# EAGLE schematic stm32-d40 (EAGLE 6.4)
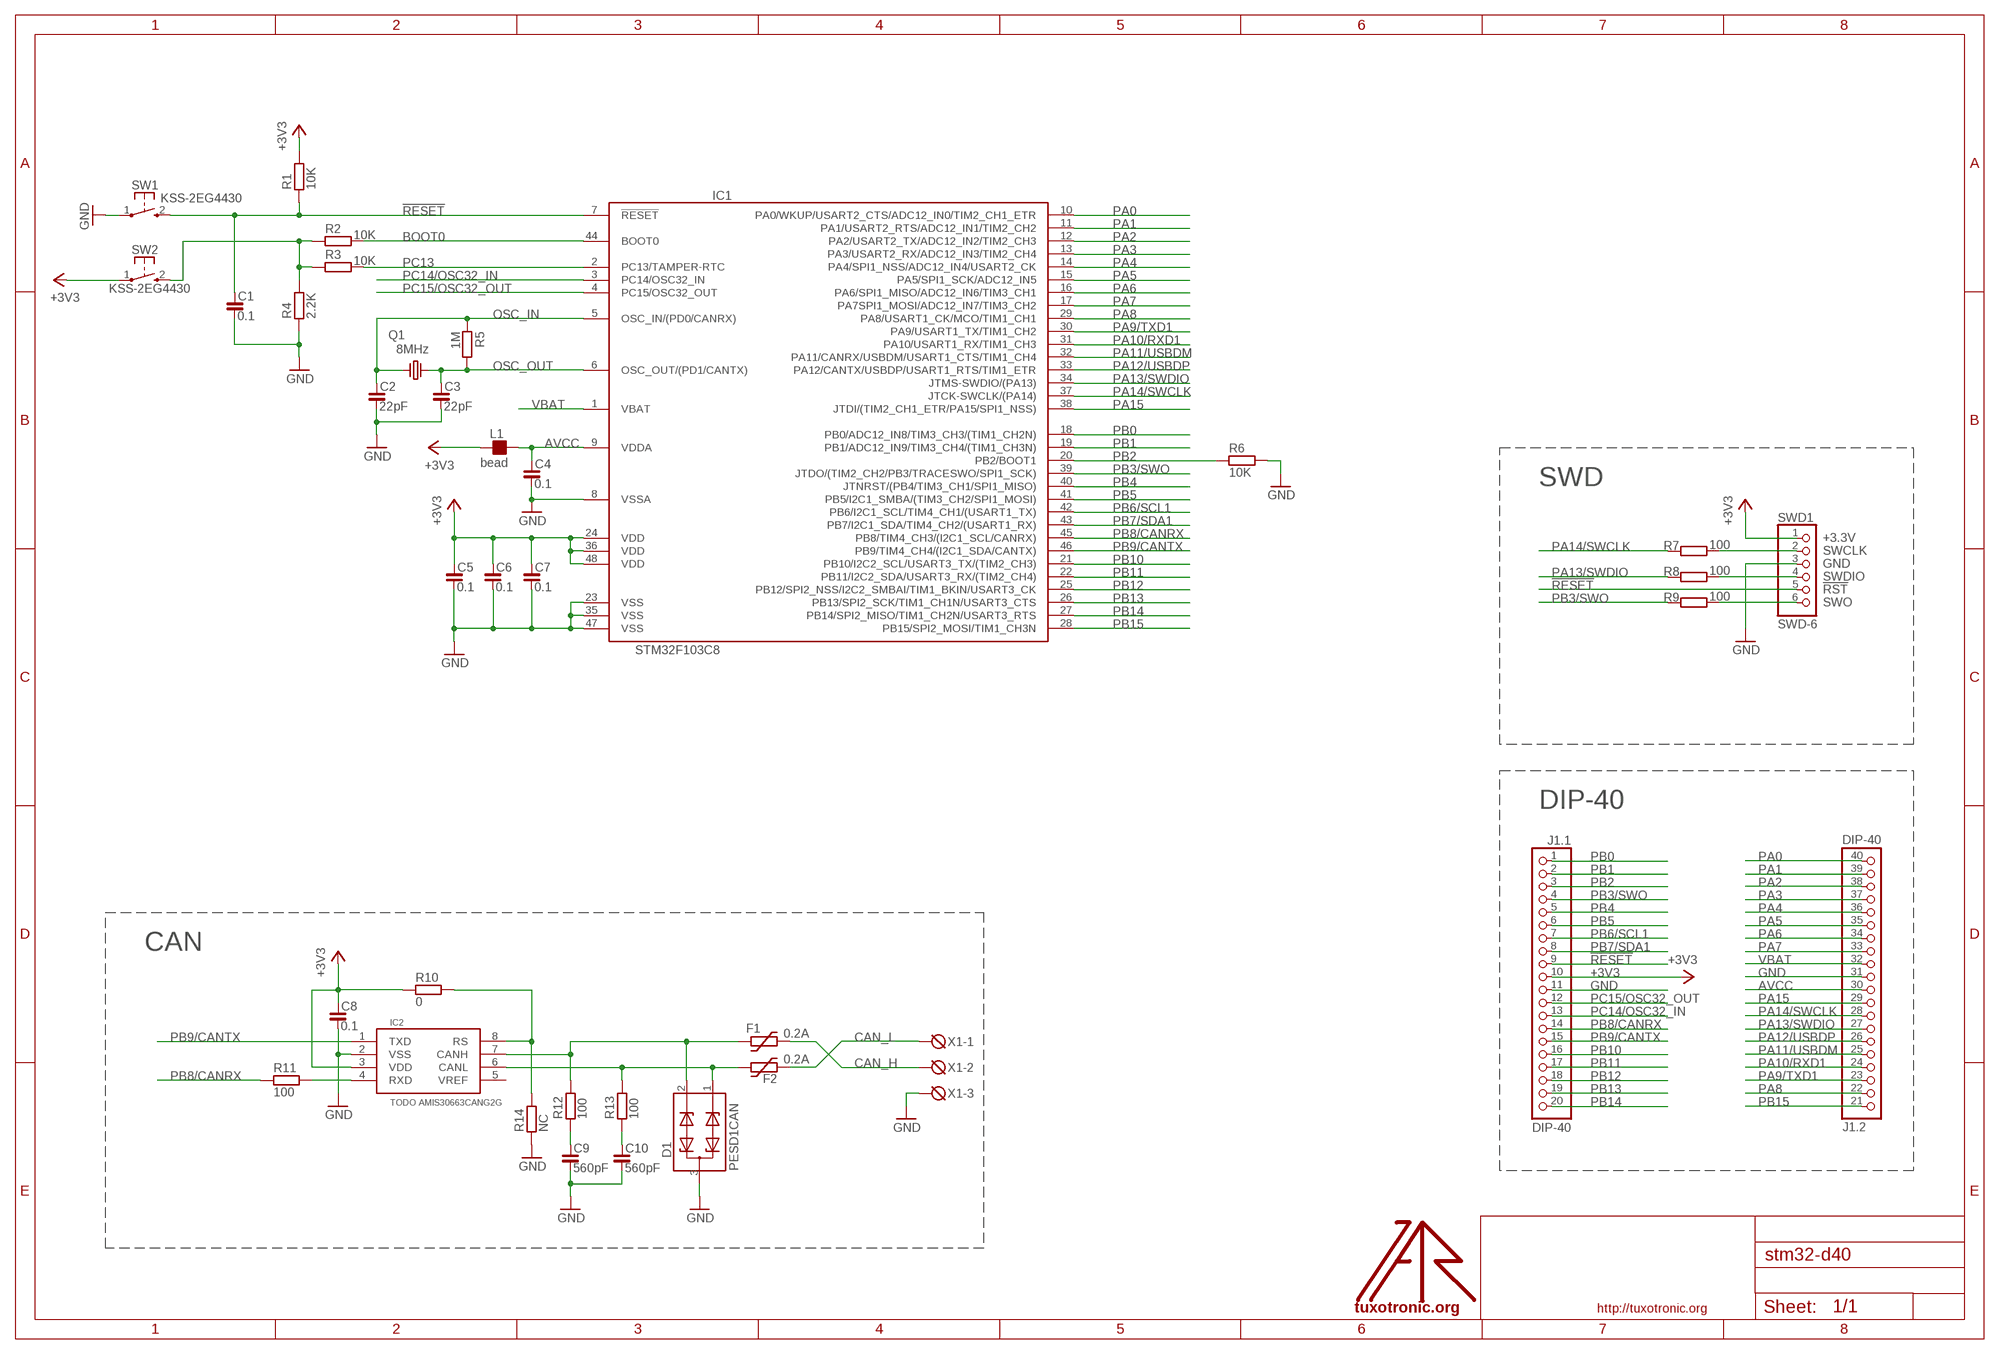
[diagram p0: schematic, sheet 1]

## Parts
C1  0.1  C_0603  [C0603]
C2  22pF  C_0603  [C0603]
C3  22pF  C_0603  [C0603]
C4  0.1  C_0603  [C0603]
C5  0.1  C_0603  [C0603]
C6  0.1  C_0603  [C0603]
C7  0.1  C_0603  [C0603]
C8  0.1  C_0603  [C0603]
C9  560pF  C_0603  [C0603]
C10  560pF  C_0603  [C0603]
D1  PESD1CAN  [SOT23]
F1  0.2A  1206L  [1206L]
F2  0.2A  1206L  [1206L]
IC1  STM32F103C8  [LQFP48]
IC2  TODO AMIS30663CANG2G  SN65HVD230  [SO08]
J1  DIP-40  [DIP-40]
L1  bead  FB_0603  [L0603]
Q1  8MHz  CRYSTAL-HC49S  [HC49/S]
R1  10K  R_0603  [R0603]
R2  10K  R_0603  [R0603]
R3  10K  R_0603  [R0603]
R4  2.2K  R_0603  [R0603]
R5  1M  R_0603  [R0603]
R6  10K  R_0603  [R0603]
R7  100  R_0603  [R0603]
R8  100  R_0603  [R0603]
R9  100  R_0603  [R0603]
R10  0  R_0603  [R0603]
R11  100  R_0603  [R0603]
R12  100  R_0603  [R0603]
R13  100  R_0603  [R0603]
R14  NC  R_0603  [R0603]
SW1  KSS-2EG4430  [KSS-2EG4430]
SW2  KSS-2EG4430  [KSS-2EG4430]
SWD1  SWD-6  [JTAG6PIN]
U$  LOGO  [TT_LOGO]
X1  DG3XX-03-3.5  [DG350-3.5-03P]

## Nets
!RESET: C1.1 IC1.7(!RESET) J1.9 R1.1 SW1.2(S) SWD1.5
+3V3: C5.1 C6.1 C7.1 C8.1 IC1.24(VDD) IC1.36(VDD) IC1.48(VDD) IC2.3(VDD) J1.10 L1.1 R1.2 R10.1 SW2.1(P) SWD1.1
AVCC: C4.1 IC1.9(VDDA) J1.30 L1.2
BOOT0: IC1.44(BOOT0) R2.2
CAN_CTRL: IC2.8(RS) R10.2 R14.2
CAN_H: F1.P$2 X1.2
CAN_L: F2.P$2 X1.1
GND: C1.2 C2.2 C3.2 C4.2 C5.2 C6.2 C7.2 C8.2 C9.2 C10.2 D1.3 IC1.8(VSSA) IC1.23(VSS) IC1.35(VSS) IC1.47(VSS) IC2.2(VSS) J1.11 J1.31 R4.1 R6.2 R14.1 SW1.1(P) SWD1.3 X1.3
N$1: R2.1 R3.1 R4.2 SW2.2(S)
N$2: R7.2 SWD1.2
N$3: R8.2 SWD1.4
N$4: R9.2 SWD1.6
N$7: IC2.4(RXD) R11.2
N$51: D1.2 F1.P$1 IC2.7(CANH) R12.2
N$52: D1.1 F2.P$1 IC2.6(CANL) R13.2
N$54: C10.1 R13.1
N$55: C9.1 R12.1
OSC_IN: C2.1 IC1.5(OSC_IN/(PD0/CANRX)) Q1.1 R5.1
OSC_OUT: C3.1 IC1.6(OSC_OUT/(PD1/CANTX)) Q1.2 R5.2
PA0: IC1.10(PA0/WKUP/USART2_CTS/ADC12_IN0/TIM2_CH1_ETR) J1.40
PA1: IC1.11(PA1/USART2_RTS/ADC12_IN1/TIM2_CH2) J1.39
PA2: IC1.12(PA2/USART2_TX/ADC12_IN2/TIM2_CH3) J1.38
PA3: IC1.13(PA3/USART2_RX/ADC12_IN3/TIM2_CH4) J1.37
PA4: IC1.14(PA4/SPI1_NSS/ADC12_IN4/USART2_CK) J1.36
PA5: IC1.15(PA5/SPI1_SCK/ADC12_IN5) J1.35
PA6: IC1.16(PA6/SPI1_MISO/ADC12_IN6/TIM3_CH1) J1.34
PA7: IC1.17(PA7SPI1_MOSI/ADC12_IN7/TIM3_CH2) J1.33
PA8: IC1.29(PA8/USART1_CK/MCO/TIM1_CH1) J1.22
PA9/TXD1: IC1.30(PA9/USART1_TX/TIM1_CH2) J1.23
PA10/RXD1: IC1.31(PA10/USART1_RX/TIM1_CH3) J1.24
PA11/USBDM: IC1.32(PA11/CANRX/USBDM/USART1_CTS/TIM1_CH4) J1.25
PA12/USBDP: IC1.33(PA12/CANTX/USBDP/USART1_RTS/TIM1_ETR) J1.26
PA13/SWDIO: IC1.34(JTMS-SWDIO/(PA13)) J1.27 R8.1
PA14/SWCLK: IC1.37(JTCK-SWCLK/(PA14)) J1.28 R7.1
PA15: IC1.38(JTDI/(TIM2_CH1_ETR/PA15/SPI1_NSS)) J1.29
PB0: IC1.18(PB0/ADC12_IN8/TIM3_CH3/(TIM1_CH2N)) J1.1
PB1: IC1.19(PB1/ADC12_IN9/TIM3_CH4/(TIM1_CH3N)) J1.2
PB2: IC1.20(PB2/BOOT1) J1.3 R6.1
PB3/SWO: IC1.39(JTDO/(TIM2_CH2/PB3/TRACESWO/SPI1_SCK)) J1.4 R9.1
PB4: IC1.40(JTNRST/(PB4/TIM3_CH1/SPI1_MISO)) J1.5
PB5: IC1.41(PB5/I2C1_SMBA/(TIM3_CH2/SPI1_MOSI)) J1.6
PB6/SCL1: IC1.42(PB6/I2C1_SCL/TIM4_CH1/(USART1_TX)) J1.7
PB7/SDA1: IC1.43(PB7/I2C1_SDA/TIM4_CH2/(USART1_RX)) J1.8
PB8/CANRX: IC1.45(PB8/TIM4_CH3/(I2C1_SCL/CANRX)) J1.14 R11.1
PB9/CANTX: IC1.46(PB9/TIM4_CH4/(I2C1_SDA/CANTX)) IC2.1(TXD) J1.15
PB10: IC1.21(PB10/I2C2_SCL/USART3_TX/(TIM2_CH3)) J1.16
PB11: IC1.22(PB11/I2C2_SDA/USART3_RX/(TIM2_CH4)) J1.17
PB12: IC1.25(PB12/SPI2_NSS/I2C2_SMBAI/TIM1_BKIN/USART3_CK) J1.18
PB13: IC1.26(PB13/SPI2_SCK/TIM1_CH1N/USART3_CTS) J1.19
PB14: IC1.27(PB14/SPI2_MISO/TIM1_CH2N/USART3_RTS) J1.20
PB15: IC1.28(PB15/SPI2_MOSI/TIM1_CH3N) J1.21
PC13: IC1.2(PC13/TAMPER-RTC) R3.2
PC14/OSC32_IN: IC1.3(PC14/OSC32_IN) J1.13
PC15/OSC32_OUT: IC1.4(PC15/OSC32_OUT) J1.12
VBAT: IC1.1(VBAT) J1.32
Unconnected: IC2.5(VREF)

## Notes on the sheet
- SWD
- DIP-40
- CAN

## Library data of the parts
C1-C10 = rc-master-smd:C_: NON-POLARIZED CAP
D1 = protect:PESD1CAN: Features Due to the integrated diode structure only one small SOT23 package is needed to protect two CAN bus lines Max. peak pulse power: PPP = 200 W at tp = 8/20 ?s Low clamping voltage: VCL = 40 V at IPP = 1 A Ultra low leakage current: IRM < 1 nA ESD protection up to 23 kV IEC 61000-4-2, level 4 (ESD) IEC 61000-4-5 (surge); IPP = 3 A at tp = 8/20 ?s Small SMD plastic package Applications CAN bus protection Automotive applications
F1 F2 = ptc-littlefuse:1206L
IC1 = stm32:STM32F103C
IC2 = interfaces:SN65HVD230: CAN PHY driver
J1 = stamp:DIP-40
L1 = rc-master-smd:FB_: FERRITE BEAD
Q1 = discrete:CRYSTAL-: CRYSTAL
R1-R14 = rc-master-smd:R_: RESISTOR
SW1 SW2 = buttons:KSS-2EG4430: Size: 3x6mm Height: 5mm from PCB Rating: DC12v 50mA Travel: 0.25±0.10mm Operating Force: 180±50gf Return Force: 60gf min Contact resistance: 100m? max Insulation resistance: 100M? min Operating life?50,000 cycles
SWD1 = jtag:SWD-6: STM32Fx Discovery
U$ = logo:LOGO
X1 = degson:DG3XX-03: DG350-3.5-03P DG306-5.0-03P